# EAGLE design CDTV-SCSI-SD (EAGLE 7.5.0)
REVISION: 0.1
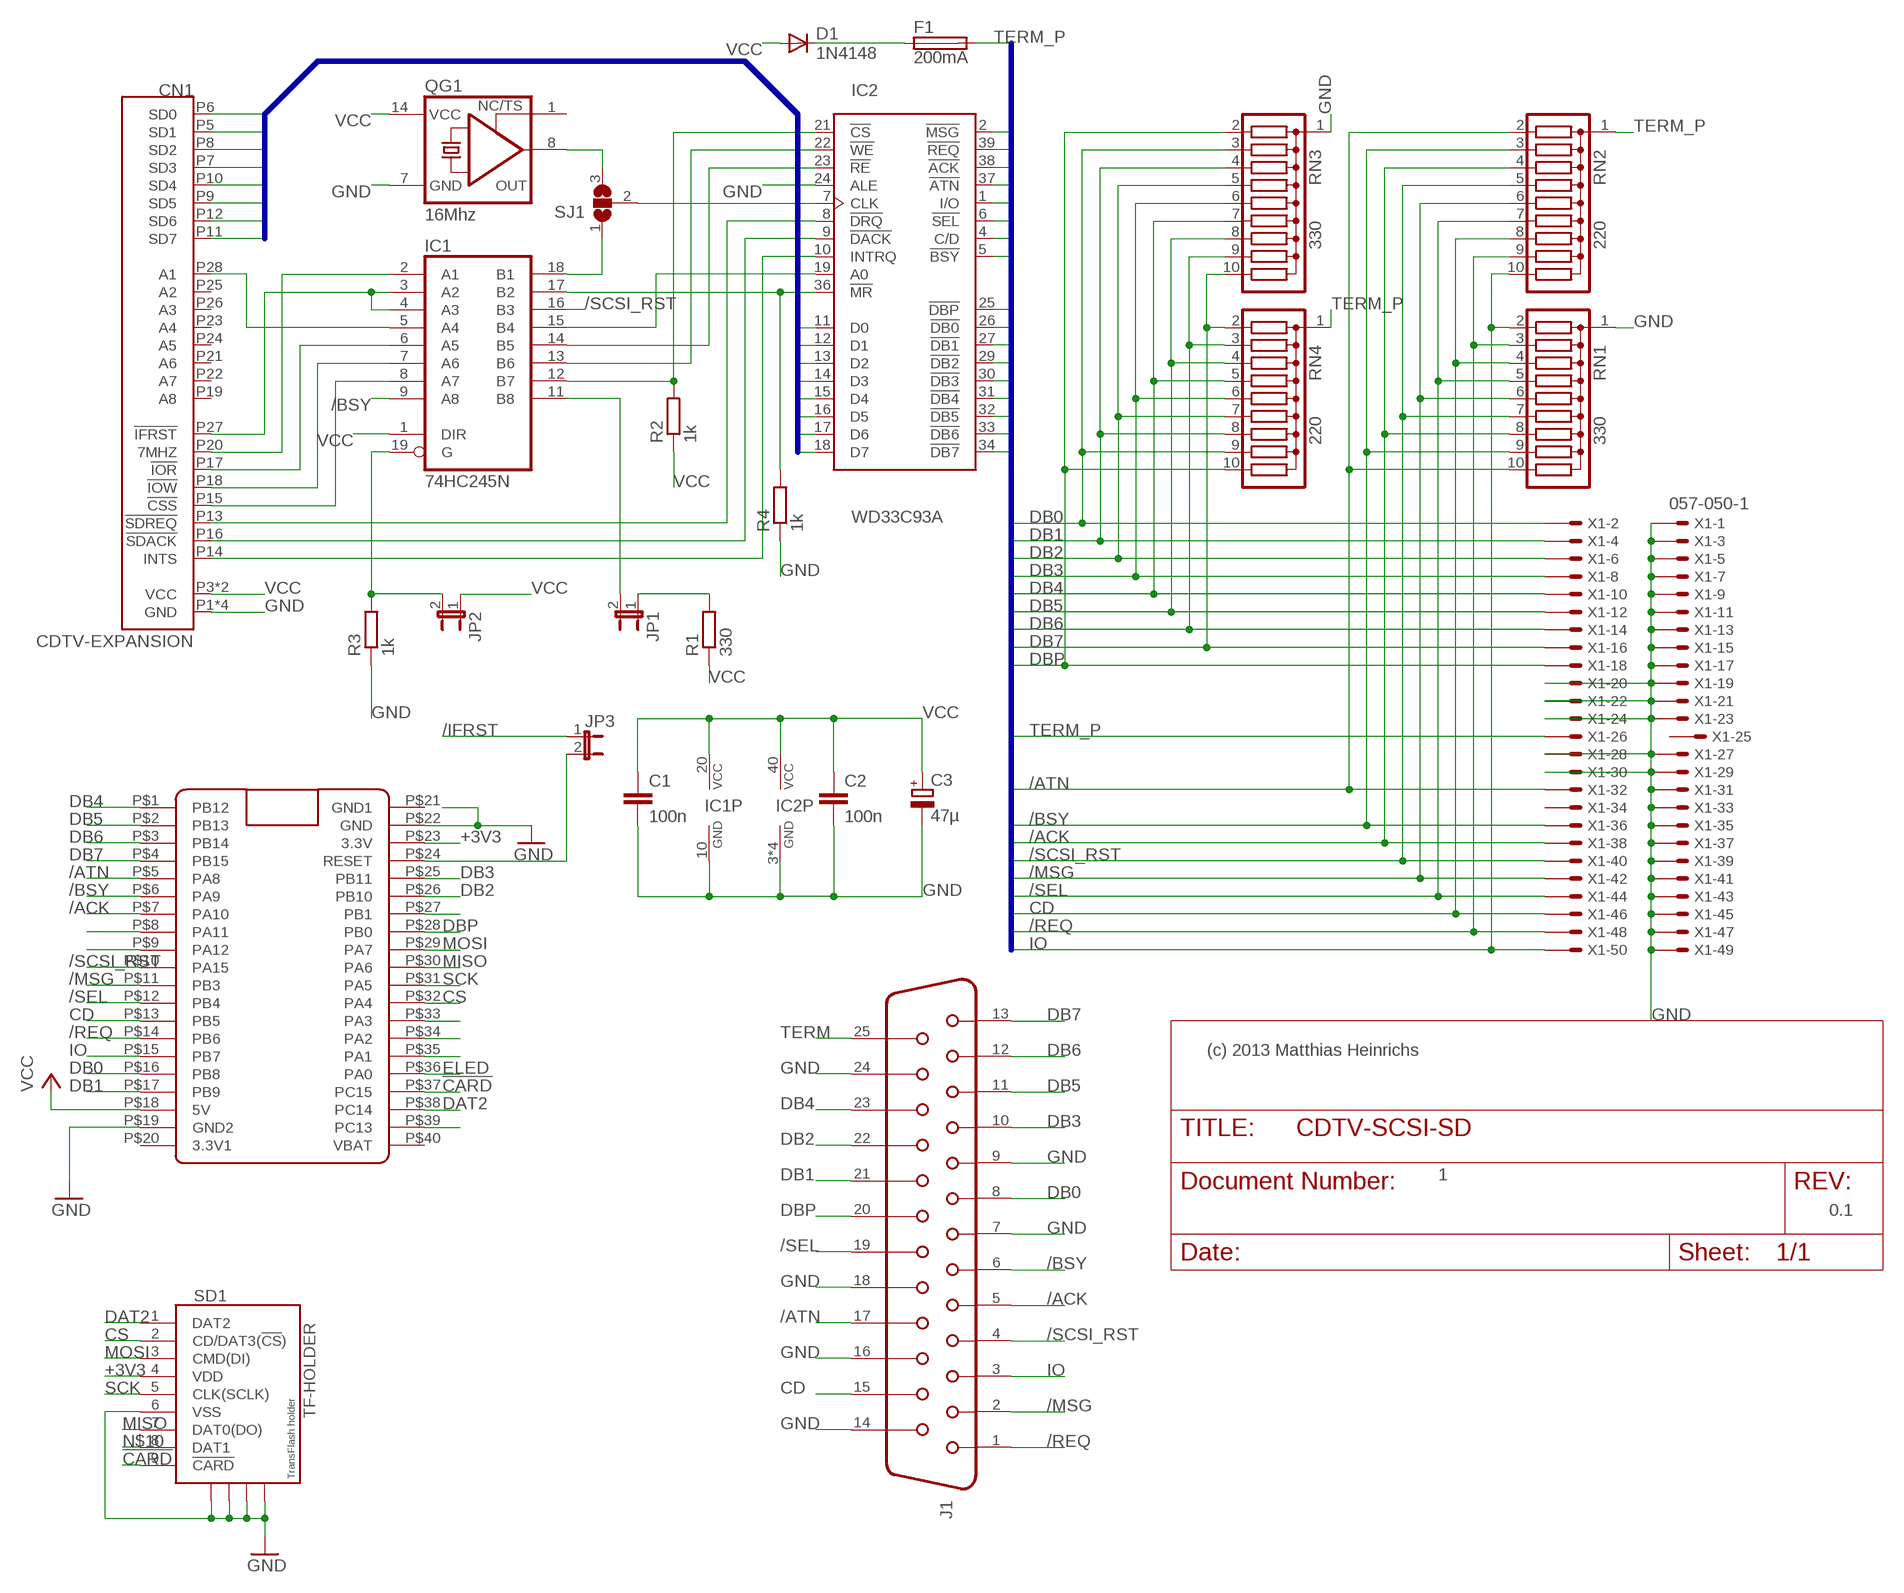
[diagram p0: schematic, sheet 1]

## Parts
C1  100n  C-EU025-024X044  [C025-024X044]
C2  100n  C-EU025-024X044  [C025-024X044]
C3  47µ  CPOL-EUE2,5-6E  [E2,5-6E]
CN1  CDTV-EXPANSION  [CDTV-SLOT]
D1  1N4148  1N4148DO35-7  [DO35-7]
F1  200mA  FUSETE5  [TE5]
IC1  74HC245N  [DIL20]
IC2  WD33C93A  WD33C93  [DIP40-6]
J1  61802529321  [61802529321]
JP1  JP1E  [JP1]
JP2  JP1E  [JP1]
JP3  JP1E  [JP1]
QG1  16Mhz  XO-14  [DIL14S]
R1  330  R-EU_0207/7  [0207/7]
R2  1k  R-EU_0207/7  [0207/7]
R3  1k  R-EU_0207/7  [0207/7]
R4  1k  R-EU_0207/7  [0207/7]
RN1  330  G09R  [SIL10]
RN2  220  G09R  [SIL10]
RN3  330  G09R  [SIL10]
RN4  220  G09R  [SIL10]
SD1  TF-HOLDER  [TF-PULL]
SJ1  SJ2W  [SJ_2]
U$1  BLUE_PILL  [BLUE_PILL]
X1  057-050-1  [057-050-1]

## Nets
7MHZ: CN1.P20(7MHZ) IC1.2(A1)
!CARD: SD1.9(!CARD) U$1.P$37(PC15)
+3V3: SD1.4(VDD) U$1.P$23(3.3V)
/ACK: IC2.38(!ACK) J1.5 RN1.8 RN2.4 U$1.P$7(PA10) X1.38
/ATN: IC2.37(!ATN) J1.17 RN1.10 RN2.2 U$1.P$5(PA8) X1.32
/BSY: IC1.9(A8) IC2.5(!BSY) J1.6 RN1.9 RN2.3 U$1.P$6(PA9) X1.36
/BSY_B: IC1.11(B8) JP1.2
/CS: IC1.12(B7) IC2.21(!CS) R2.2
/CSS: CN1.P15(!CSS) IC1.8(A7)
/ENABLE: IC1.19(G) JP2.2 R3.2
/IFRST: CN1.P27(!IFRST) IC1.3(A2) IC1.4(A3) JP3.1
/INTS: CN1.P14(INTS) IC2.10(INTRQ)
/IOR: CN1.P17(!IOR) IC1.6(A5)
/IOW: CN1.P18(!IOW) IC1.7(A6)
/MR: IC1.17(B2) IC2.36(!MR) R4.2
/MSG: IC2.2(!MSG) J1.2 RN1.6 RN2.6 U$1.P$11(PB3) X1.42
/RE: IC1.14(B5) IC2.23(!RE)
/REQ: IC2.39(!REQ) J1.1 RN1.3 RN2.9 U$1.P$14(PB6) X1.48
/SCSI_RST: IC1.16(B3) J1.4 RN1.7 RN2.5 U$1.P$10(PA15) X1.40
/SDACK: CN1.P16(!SDACK) IC2.9(!DACK)
/SDREQ: CN1.P13(!SDREQ) IC2.8(!DRQ)
/SEL: IC2.6(!SEL) J1.19 RN1.5 RN2.7 U$1.P$12(PB4) X1.44
/WE: IC1.13(B6) IC2.22(!WE)
A1: CN1.P28(A1) IC1.5(A4)
B_A1: IC1.15(B4) IC2.19(A0)
CD: IC2.4(C/D) J1.15 RN1.4 RN2.8 U$1.P$13(PB5) X1.46
CLK: IC2.7(CLK) SJ1.2
CLK_7: IC1.18(B1) SJ1.1
CLK_16M: QG1.8(OUT) SJ1.3
CS: SD1.2(CD/DAT3(!CS!)) U$1.P$32(PA4)
DAT2: SD1.1(DAT2) U$1.P$38(PC14)
DB0: IC2.26(!DB0) J1.8 RN3.3 RN4.9 U$1.P$16(PB8) X1.2
DB1: IC2.27(!DB1) J1.21 RN3.4 RN4.8 U$1.P$17(PB9) X1.4
DB2: IC2.29(!DB2) J1.22 RN3.5 RN4.7 U$1.P$26(PB10) X1.6
DB3: IC2.30(!DB3) J1.10 RN3.6 RN4.6 U$1.P$25(PB11) X1.8
DB4: IC2.31(!DB4) J1.23 RN3.7 RN4.5 U$1.P$1(PB12) X1.10
DB5: IC2.32(!DB5) J1.11 RN3.8 RN4.4 U$1.P$2(PB13) X1.12
DB6: IC2.33(!DB6) J1.12 RN3.9 RN4.3 U$1.P$3(PB14) X1.14
DB7: IC2.34(!DB7) J1.13 RN3.10 RN4.2 U$1.P$4(PB15) X1.16
DBP: IC2.25(!DBP) J1.20 RN3.2 RN4.10 U$1.P$28(PB0) X1.18
ELED: U$1.P$36(PA0)
GND: C1.2 C2.2 C3.- CN1.P1(GND) CN1.P2(GND) CN1.P29(GND) CN1.P30(GND) IC1.10(GND) IC2.3(GND1) IC2.20(GND1) IC2.24(ALE) IC2.28(GND1) IC2.35(GND1) J1.7 J1.9 J1.14 J1.16 J1.18 J1.24 QG1.7(GND) R3.1 R4.1 RN1.1 RN3.1 SD1.6(VSS) SD1.S1 SD1.S2 SD1.S3 SD1.S4 U$1.P$19(GND2) U$1.P$22(GND) X1.1 X1.3 X1.5 X1.7 X1.9 X1.11 X1.13 X1.15 X1.17 X1.19 X1.20 X1.21 X1.22 X1.23 X1.24 X1.27 X1.28 X1.29 X1.30 X1.31 X1.33 X1.35 X1.37 X1.39 X1.41 X1.43 X1.45 X1.47 X1.49
IO: IC2.1(I/O) J1.3 RN1.2 RN2.10 U$1.P$15(PB7) X1.50
LED_POW: JP1.1 R1.2
MISO: SD1.7(DAT0(DO)) U$1.P$30(PA6)
MOSI: SD1.3(CMD(DI)) U$1.P$29(PA7)
N$2: U$1.P$39(PC13)
N$6: U$1.P$35(PA1)
N$7: U$1.P$34(PA2)
N$8: U$1.P$33(PA3)
N$10: SD1.8(DAT1)
N$21: U$1.P$27(PB1)
N$24: JP3.2 U$1.P$24(RESET)
N$34: U$1.P$9(PA12)
N$35: U$1.P$8(PA11)
SCK: SD1.5(CLK(SCLK)) U$1.P$31(PA5)
SD0: CN1.P6(SD0) IC2.11(D0)
SD1: CN1.P5(SD1) IC2.12(D1)
SD2: CN1.P8(SD2) IC2.13(D2)
SD3: CN1.P7(SD3) IC2.14(D3)
SD4: CN1.P10(SD4) IC2.15(D4)
SD5: CN1.P9(SD5) IC2.16(D5)
SD6: CN1.P12(SD6) IC2.17(D6)
SD7: CN1.P11(SD7) IC2.18(D7)
TERM: J1.25
TERM_P: F1.2 RN2.1 RN4.1 X1.26
TP_UNFUSED: D1.C F1.1
VCC: C1.1 C2.1 C3.+ CN1.P3(VCC) CN1.P4(VCC) D1.A IC1.1(DIR) IC1.20(VCC) IC2.40(VCC1) JP2.1 QG1.14(VCC) R1.1 R2.1 U$1.P$18(5V)
Unconnected: CN1.P19(A8) CN1.P21(A6) CN1.P22(A7) CN1.P23(A4) CN1.P24(A5) CN1.P25(A2) CN1.P26(A3) QG1.1(TS) U$1.P$20(3.3V1) U$1.P$40(VBAT) X1.25 X1.34

## Buses
SD[0..7]
DB[0..7],/MSG,/REQ,/ACK,/ATN,IO,/SEL,CD,/BSY,DBP,TERM_P,/SCSI_RST

## Notes on the sheet
- (c) 2013 Matthias Heinrichs
- 1
- 0.1

## Power pins joined to a net without a drawn wire
GND1: U$1.P$21(GND1)

## Library data of the parts
C1 C2 = rcl:C-EU: CAPACITOR, European symbol
C3 = rcl:CPOL-EU: POLARIZED CAPACITOR, European symbol
CN1 = Amiga:CDTV-EXPANSION: Expansion Port for CDTV and A570
D1 = diode:1N4148: DIODE high speed (Philips)
F1 = fuse:FUSE: Fuse; OC_FARNELL: unknown; OC_NEWARK: unknown
IC1 = 74xx-eu:74*245: Octal BUS TRANSCEIVER, 3-state
IC2 = Amiga:WD33C93: WD33C93 -SCSI-Chip WD33C93A AM33C93 P16
J1 = InputOutputIO (rev18a):61802529321: WR-DSUB Female PCB Connector with Hex Screw, 25 Pins=>Code : Con_I-O_DSUB_PCB_Female_w-screw_61802529321 <http://katalog.we-online.de/media/images/eican/Con_I-O_DSUB_PCB_Female_w-screw_6180xx29321_pf2.jpg> Details see: http://katalog.we-online.de/en/em/DSUB_FEMALE_PCB_CONNECTOR_W_HEX_SCREW_6180XX29321 Created 2014-07-10, Karrer Zheng 2014 (C) Würth Elektronik
JP1-JP3 = jumper:JP1E: JUMPER
QG1 = crystal:XO-: CRYSTAL; OC_FARNELL: unknown; OC_NEWARK: unknown
R1-R4 = rcl:R-EU_: RESISTOR, European symbol
RN1-RN4 = resistor-sil:G09R: SIL RESISTOR; OC_FARNELL: unknown; OC_NEWARK: unknown
SD1 = sd-mmc:TF-HOLDER: TF / Micro SD socket is PUSH-PUSH type, the card can be pushed into and auto locked and pushed out by simply press the card. Surface Mounting type.
SJ1 = jumper:SJ2W: SMD solder JUMPER
U$1 = BluePill:BLUE_PILL
X1 = con-panduit:057-050-: CONNECTOR 50-pin series 057 contact pc board low profile headers; OC_FARNELL: unknown; OC_NEWARK: unknown

## Board
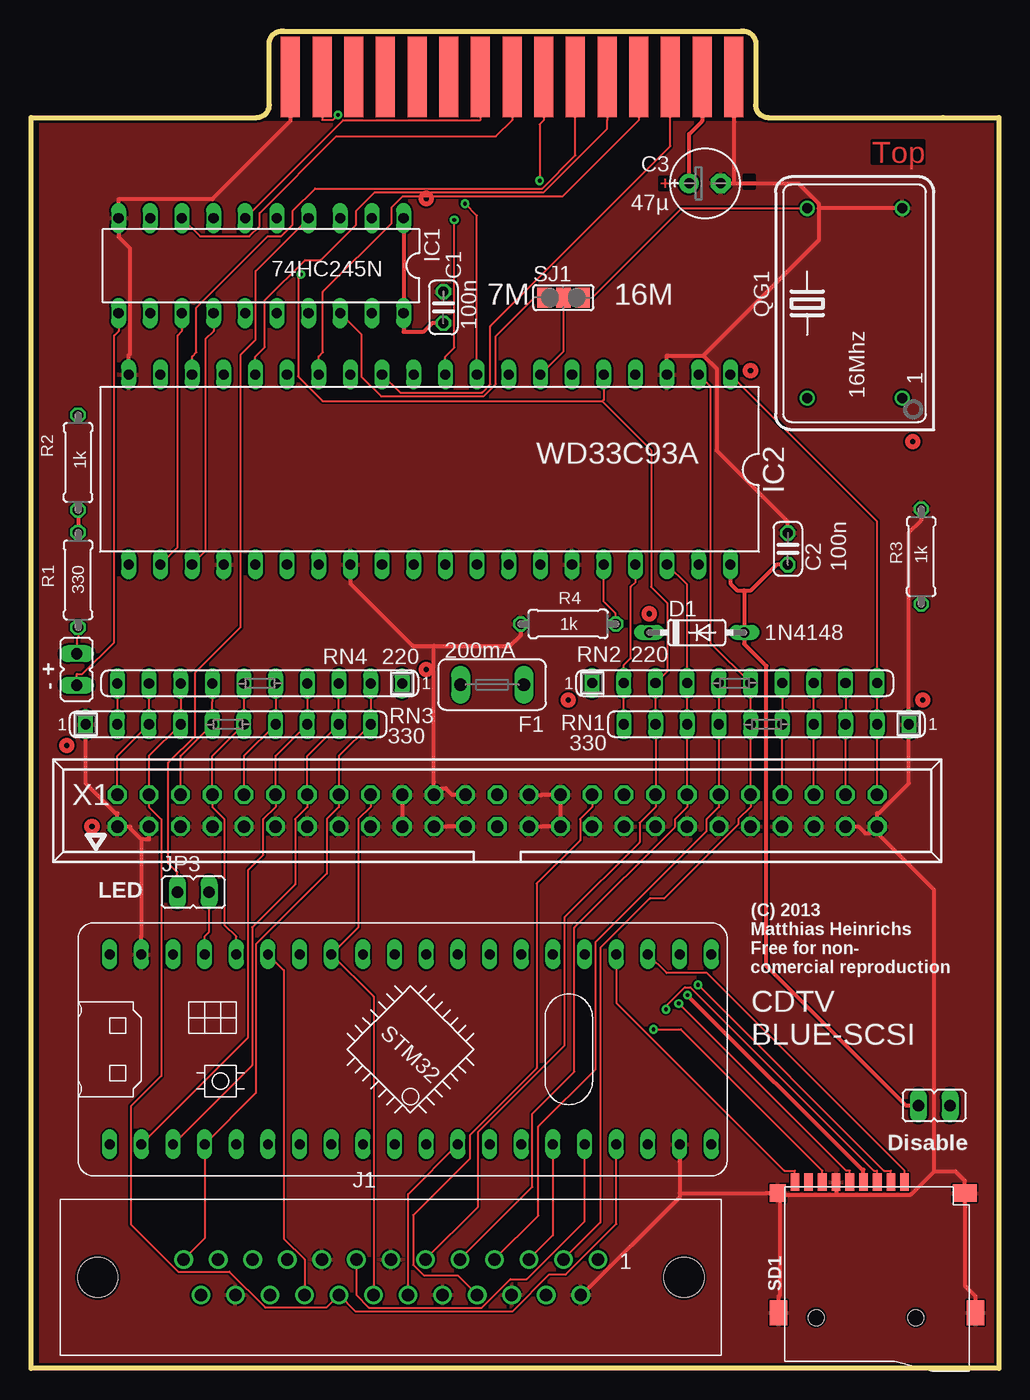
[diagram p1: board, top side]
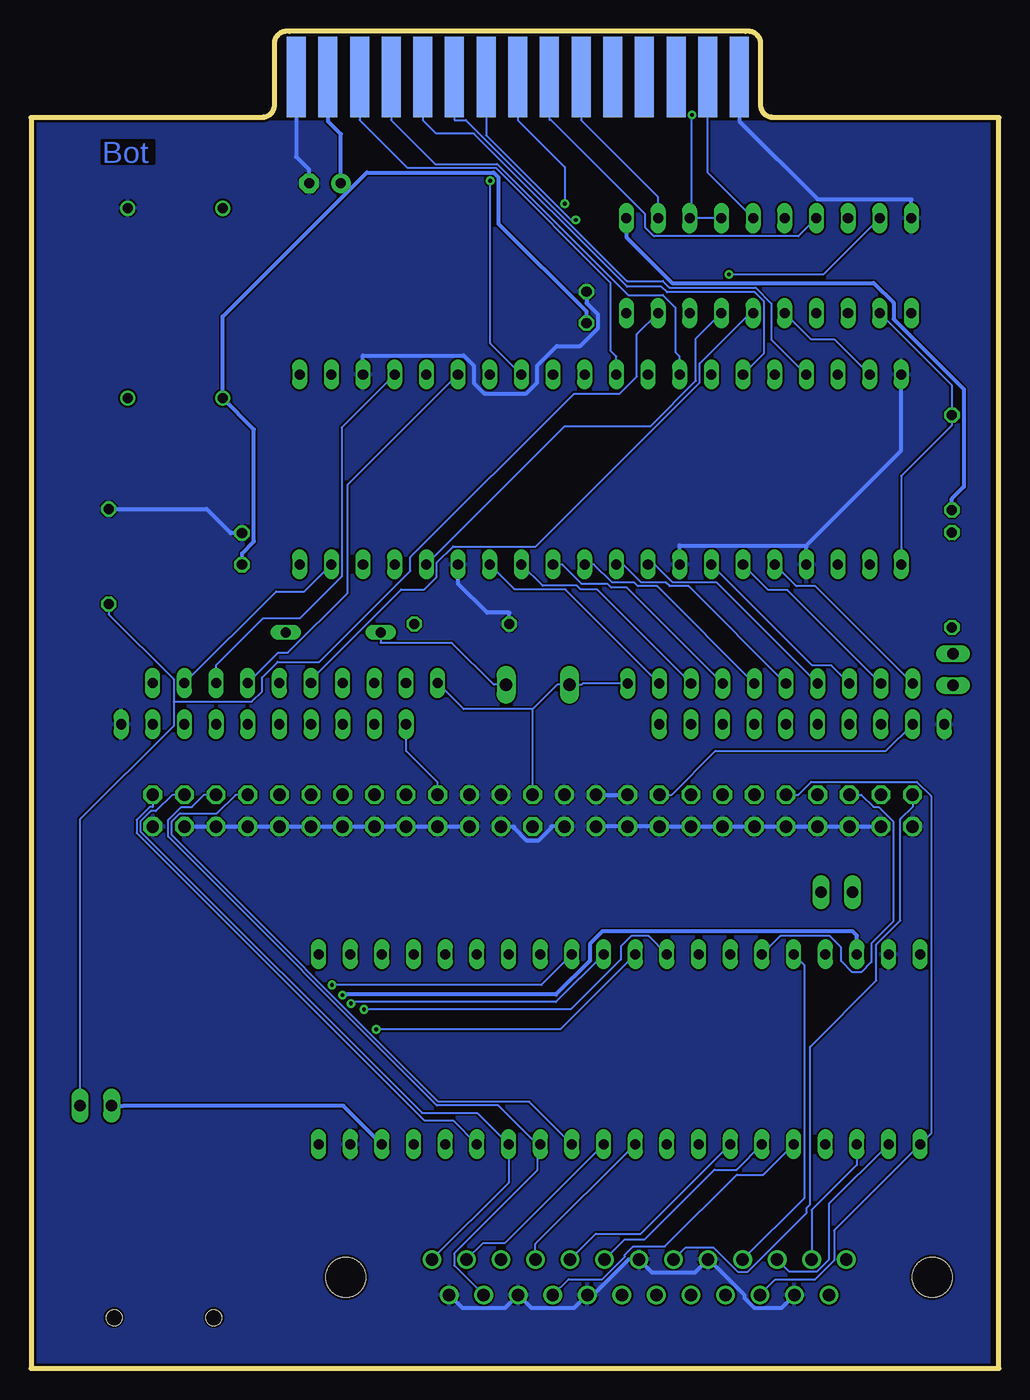
[diagram p2: board, bottom side, seen from below]

Size 77.62 x 107.31 mm. Coordinates in mm from the lower left corner, seen from the top.
Outline: 0,0 0,100.38 18.1,100.38 arc90 19.1,101.38 19.1,106.48 arc-90 20.32,107.29 56.9,107.29 arc-90 58.12,106.48 58.12,101.38 arc90 59.12,100.38 73.15,100.38 77.62,100.38 77.62,0 0,0
Copper layers (1*16): Top 0.035mm / dielectric 1.5mm / Bottom 0.035mm
Design rules "platinensammler_02": minimum track width 0.15mm, minimum drill 0.3mm, track to track 0.15mm, track to pad 0.15mm, pad to pad 0.15mm, via to via 0.15mm, smd to smd 0mil, copper to edge 0.2mm, drill to drill 0.2mm, minimum pad ring 0.2mm, minimum via ring 0.2mm, stop-mask expansion 4mil, vias tented up to drill 0.8mm, thermal gap 0.15mm

### Footprints (pad centres in the part's own frame; a part is rotated, then mirrored left to right if it is on the bottom)
C025-024X044 = drill 0.813 octagon: 1 -1.27,0; 2 1.27,0
E2,5-6E = drill 0.813 pad 1.575: + -1.27,0 | drill 0.813 pad 1.575 octagon: - 1.27,0
CDTV-SLOT = smd 1.524 x 6.477: P1 -17.78,-2.54; P3 -15.24,-2.54; P5 -12.7,-2.54; P7 -10.16,-2.54; P9 -7.62,-2.54; P11 -5.08,-2.54; P13 -2.54,-2.54; P15 0,-2.54; P17 2.54,-2.54; P19 5.08,-2.54; P21 7.62,-2.54; P23 10.16,-2.54; P25 12.7,-2.54; P27 15.24,-2.54; P29 17.78,-2.54 | smd 1.524 x 6.477 bottom: P2 -17.78,-2.54; P4 -15.24,-2.54; P6 -12.7,-2.54; P8 -10.16,-2.54; P10 -7.62,-2.54; P12 -5.08,-2.54; P14 -2.54,-2.54; P16 0,-2.54; P18 2.54,-2.54; P20 5.08,-2.54; P22 7.62,-2.54; P24 10.16,-2.54; P26 12.7,-2.54; P28 15.24,-2.54; P30 17.78,-2.54
DO35-7 = drill 0.813 long: A 3.81,0; C -3.81,0
TE5 = drill 1.016 long: 1 -2.54,0; 2 2.54,0
DIL20 = drill 0.813 long: 1 -11.43,-3.81; 2 -8.89,-3.81; 3 -6.35,-3.81; 4 -3.81,-3.81; 5 -1.27,-3.81; 6 1.27,-3.81; 7 3.81,-3.81; 8 6.35,-3.81; 9 8.89,-3.81; 10 11.43,-3.81; 11 11.43,3.81; 12 8.89,3.81; 13 6.35,3.81; 14 3.81,3.81; 15 1.27,3.81; 16 -1.27,3.81; 17 -3.81,3.81; 18 -6.35,3.81; 19 -8.89,3.81; 20 -11.43,3.81
DIP40-6 = drill 0.813 long: 1 -24.13,-7.62; 2 -21.59,-7.62; 3 -19.05,-7.62; 4 -16.51,-7.62; 5 -13.97,-7.62; 6 -11.43,-7.62; 7 -8.89,-7.62; 8 -6.35,-7.62; 9 -3.81,-7.62; 10 -1.27,-7.62; 11 1.27,-7.62; 12 3.81,-7.62; 13 6.35,-7.62; 14 8.89,-7.62; 15 11.43,-7.62; 16 13.97,-7.62; 17 16.51,-7.62; 18 19.05,-7.62; 19 21.59,-7.62; 20 24.13,-7.62; 21 24.13,7.62; 22 21.59,7.62; 23 19.05,7.62; 24 16.51,7.62; 25 13.97,7.62; 26 11.43,7.62; 27 8.89,7.62; 28 6.35,7.62; 29 3.81,7.62; 30 1.27,7.62; 31 -1.27,7.62; 32 -3.81,7.62; 33 -6.35,7.62; 34 -8.89,7.62; 35 -11.43,7.62; 36 -13.97,7.62; 37 -16.51,7.62; 38 -19.05,7.62; 39 -21.59,7.62; 40 -24.13,7.62
61802529321 = drill 1: 1 16.62,1.42; 2 13.85,1.42; 3 11.08,1.42; 4 8.31,1.42; 5 5.54,1.42; 6 2.77,1.42; 7 0,1.42; 8 -2.77,1.42; 9 -5.54,1.42; 10 -8.31,1.42; 11 -11.08,1.42; 12 -13.85,1.42; 13 -16.62,1.42; 14 15.235,-1.42; 15 12.465,-1.42; 16 9.695,-1.42; 17 6.925,-1.42; 18 4.155,-1.42; 19 1.385,-1.42; 20 -1.385,-1.42; 21 -4.155,-1.42; 22 -6.925,-1.42; 23 -9.695,-1.42; 24 -12.465,-1.42; 25 -15.235,-1.42 | hole 3.2: -23.52,0; 23.52,0
JP1 = drill 0.914 long: 1 0,-1.27; 2 0,1.27
DIL14S = drill 0.813: 1 -7.62,-3.81; 7 7.62,-3.81; 8 7.62,3.81; 14 -7.62,3.81
0207/7 = drill 0.813 octagon: 1 -3.81,0; 2 3.81,0
SIL10 = drill 0.813 long: 1 -11.43,0; 2 -8.89,0; 3 -6.35,0; 4 -3.81,0; 5 -1.27,0; 6 1.27,0; 7 3.81,0; 8 6.35,0; 9 8.89,0; 10 11.43,0
TF-PULL = smd 0.7 x 1.4: 1 -2.2,-7.62; 2 -1.1,-7.62; 3 0,-7.62; 4 1.1,-7.62; 5 2.2,-7.62; 6 3.3,-7.62; 7 4.4,-7.62; 8 5.5,-7.62; 9 6.6,-7.62 | smd 1.4 x 2: S1 -7.9,2.85; S2 7.9,2.85 | smd 1.28 x 1.4: S3 7.96,-6.75 | smd 1.95 x 1.4: S4 -7.025,-6.75 | hole 1.25: -3.1,3.25; 4.9,3.25
SJ_2 = smd 1.168 x 1.6: 1 -1.524,0; 2 0,0; 3 1.524,0
BLUE_PILL = drill 0.8 long: P$1 -7.62,15.24; P$2 -7.62,12.7; P$3 -7.62,10.16; P$4 -7.62,7.62; P$5 -7.62,5.08; P$6 -7.62,2.54; P$7 -7.62,0; P$8 -7.62,-2.54; P$9 -7.62,-5.08; P$10 -7.62,-7.62; P$11 -7.62,-10.16; P$12 -7.62,-12.7; P$13 -7.62,-15.24; P$14 -7.62,-17.78; P$15 -7.62,-20.32; P$16 -7.62,-22.86; P$17 -7.62,-25.4; P$18 -7.62,-27.94; P$19 -7.62,-30.48; P$20 -7.62,-33.02; P$21 7.62,15.24; P$22 7.62,12.7; P$23 7.62,10.16; P$24 7.62,7.62; P$25 7.62,5.08; P$26 7.62,2.54; P$27 7.62,0; P$28 7.62,-2.54; P$29 7.62,-5.08; P$30 7.62,-7.62; P$31 7.62,-10.16; P$32 7.62,-12.7; P$33 7.62,-15.24; P$34 7.62,-17.78; P$35 7.62,-20.32; P$36 7.62,-22.86; P$37 7.62,-25.4; P$38 7.62,-27.94; P$39 7.62,-30.48; P$40 7.62,-33.02
057-050-1 = drill 1 octagon: 1 -30.48,-1.27; 2 -30.48,1.27; 3 -27.94,-1.27; 4 -27.94,1.27; 5 -25.4,-1.27; 6 -25.4,1.27; 7 -22.86,-1.27; 8 -22.86,1.27; 9 -20.32,-1.27; 10 -20.32,1.27; 11 -17.78,-1.27; 12 -17.78,1.27; 13 -15.24,-1.27; 14 -15.24,1.27; 15 -12.7,-1.27; 16 -12.7,1.27; 17 -10.16,-1.27; 18 -10.16,1.27; 19 -7.62,-1.27; 20 -7.62,1.27; 21 -5.08,-1.27; 22 -5.08,1.27; 23 -2.54,-1.27; 24 -2.54,1.27; 25 0,-1.27; 26 0,1.27; 27 2.54,-1.27; 28 2.54,1.27; 29 5.08,-1.27; 30 5.08,1.27; 31 7.62,-1.27; 32 7.62,1.27; 33 10.16,-1.27; 34 10.16,1.27; 35 12.7,-1.27; 36 12.7,1.27; 37 15.24,-1.27; 38 15.24,1.27; 39 17.78,-1.27; 40 17.78,1.27; 41 20.32,-1.27; 42 20.32,1.27; 43 22.86,-1.27; 44 22.86,1.27; 45 25.4,-1.27; 46 25.4,1.27; 47 27.94,-1.27; 48 27.94,1.27; 49 30.48,-1.27; 50 30.48,1.27

### Placement (x,y rotation side)
C1  33.07,85.14 90 top
C2  60.71,65.76 90 top
C3  54.05,95.1 0 top
CN1  38.58,101.09 180 top
D1  53.39,59.05 0 top
F1  36.98,54.86 180 top
IC1  18.44,88.49 180 top
IC2  31.95,72.14 180 top
J1  28.85,7.32 0 top
JP1  3.66,56.08 180 top
JP2  72.44,21.08 270 top
JP3  13,38.2 270 top
QG1  66.07,85.47 90 top
R1  3.76,63.27 270 top
R2  3.76,72.69 90 top
R3  71.4,65.15 270 top
R4  43.08,59.74 0 top
RN1  58.98,51.69 180 top
RN2  56.44,54.99 0 top
RN3  15.8,51.69 0 top
RN4  18.34,54.97 180 top
SD1  67.87,7.32 180 top
SJ1  42.7,85.93 0 top
U$1  21.54,25.6 90 top
X1  37.39,44.75 0 top

### Tracks (layer width: path | path; a pad name or v marks a point on that pad's centre or on a via)
7MHZ
  Bottom 0.15: CN1.P20 33.5,100.17 27.33,94 IC1.2
!CARD
  Top 0.15: U$1.P$37 46.94,31.8 46.94,29.34 60.41,15.86 61.27,15.86 SD1.9
+3V3  (via drill 0.3 pad 0.7)
  Top 0.305: v52.64,29.95 66.65,15.94 66.77,15.94 SD1.4
  Bottom 0.305: 52.59,30 35.52,30 32.81,32.71 32.81,34.05 31.79,35.07 11.72,35.07 11.38,34.73 U$1.P$23 | 52.59,30 | 52.59,30 v52.64,29.95
/ACK
  Top 0.15: IC2.38 52.63,62.89 RN2.4 RN1.8 X1.38 52.63,45.05 51.65,44.07 51.65,43.46 43.57,35.38 43.57,23.8 40.21,20.43 40.21,14.55 J1.5
  Bottom 0.15: J1.5 32.33,10.8 28.72,10.8 U$1.P$7
/ATN
  Top 0.15: IC2.37 48.46,63.07 48.12,62.73 48.12,57 47.55,56.44 RN2.2 RN1.10 | J1.17 34.23,7.45 31.51,7.45 30.65,8.31 30.65,12.29 35.18,16.83 35.18,18.72 40.55,24.09 40.55,38.9 44.03,42.38 44.03,44.07 45.01,45.05 X1.32
  Bottom 0.15: J1.17 34.51,7.16 31.8,7.16 29.99,8.97 29.99,9.11 29.33,9.78 26.78,9.78 21.01,15.54 18.9,15.54 U$1.P$5 | X1.32 45.01,47 47.55,49.54 RN1.10
/BSY  (via drill 0.3 pad 0.7)
  Top 0.15: v21.64,87.78 21.42,87.56 21.42,79.59 23.39,77.61 45.83,77.61 | IC2.5 45.92,77.71 45.83,77.61 | 45.83,77.61 49.73,73.71 49.73,62.71 51.04,61.41 51.04,55.94 RN2.3 RN1.9 X1.36 50.09,45.05 48.81,43.77 48.81,42.2 42.78,36.17 42.78,25.89 35.83,18.93 35.83,12.94 J1.6
  Bottom 0.15: IC1.9 14.07,87.78 v21.64,87.78 | v21.64,87.78 | J1.6 30.01,10.35 28.41,10.35 22.82,15.95 21.03,15.95 U$1.P$6
/BSY_B
  Top 0.15: IC1.11 7.01,83.24 6.65,82.88 6.65,58.26 4.11,55.72 3.66,55.72 JP1.2
/CS
  Bottom 0.15: IC2.21 7.82,71.61 3.76,75.67 R2.2 3.76,78.89 IC1.12
/CSS
  Top 0.15: CN1.P15 38.58,100.17 37.29,98.87 24.49,98.87 18.33,92.72 18.33,91.66 17.51,90.85 13.55,90.85 IC1.8
/ENABLE
  Bottom 0.15: 66.2,53.5 59.92,53.5 59.08,54.34 59.08,55.45 57.85,56.68 54.5,56.68 47.19,63.99 47.19,65.1 34.07,78.22 30.41,78.22 29.04,79.59 29.04,82.98 IC1.19 | 66.2,53.5 66.2,51.54 73.71,44.03 JP2.2 | 66.2,53.5 66.2,55.31 71.4,60.51 R3.2
/IFRST  (via drill 0.3 pad 0.7)
  Top 0.15: JP3.1 11.73,39.8 11.01,40.52 11.01,48.61 13.15,50.75 13.15,55.82 16.81,59.48 16.81,81.34 18.01,82.54 18.01,88.06 IC1.4 | v24.61,100.57 24.21,100.17 23.34,100.17 CN1.P27
  Bottom 0.15: 24.61,92.3 IC1.3 | IC1.4 24.61,92.3 | 24.61,92.3 v24.61,100.57
/INTS  (via drill 0.3 pad 0.7)
  Top 0.15: IC2.10 33.22,81.2 33.94,81.92 v33.94,92.17
  Bottom 0.15: CN1.P14 41.12,98.96 34.33,92.17 v33.94,92.17
/IOR
  Top 0.15: CN1.P17 36.04,100.17 25.04,100.17 IC1.6
/IOW
  Bottom 0.15: CN1.P18 36.04,100.17 35.9,100.17 28.37,92.64 28.37,91.55 27.68,90.86 16.08,90.86 IC1.7
/MR
  Top 0.15: R4.2 46.89,60.58 45.92,61.54 IC2.36
  Bottom 0.15: IC2.36 34.82,75.61 27.93,75.61 24.29,79.25 24.29,82.64 | 24.29,82.64 | 24.29,82.64 IC1.17
/MSG
  Top 0.15: J1.2 45.67,11.7 45.67,33.72 49.64,37.69 50.77,37.69 56.73,43.65 56.73,44.07 57.71,45.05 X1.42 RN1.6 RN2.6 54.51,58.19 54.51,78.79 IC2.2
  Bottom 0.15: U$1.P$11 39.63,10.05 41.39,10.05 J1.2
/RE
  Top 0.15: IC2.23 13.98,65.6 13.98,82.59 14.63,83.24 IC1.14
/REQ
  Top 0.15: X1.48 RN1.3 RN2.9
  Bottom 0.15: 41.82,20.49 46.26,20.49 68.85,43.08 68.85,43.88 68.02,44.71 67.62,44.71 66.3,46.02 X1.48 | 41.82,20.49 | 41.82,20.49 U$1.P$14 39.32,14.89 J1.1 | RN2.9 57.97,62.35 55.71,62.35 IC2.39
/SCSI_RST
  Top 0.15: J1.4 40.68,12.25 40.68,19.41 45.27,24 45.27,34.21 54.19,43.13 54.19,44.07 55.17,45.05 X1.40 RN1.7 RN2.5
  Bottom 0.15: RN2.5 55.17,55.28 47.94,62.51 46.07,62.51 45.09,63.49 45.09,64.65 43.77,65.96 37.14,65.96 23.99,79.11 23.99,80.64 19.95,84.68 IC1.16 | J1.4 37.16,9.98 U$1.P$10
/SDACK  (via drill 0.3 pad 0.7)
  Top 0.15: IC2.9 35.76,92.52 v34.81,93.47
  Bottom 0.15: v34.81,93.47 34.81,96.39 38.58,100.17 CN1.P16
/SDREQ  (via drill 0.3 pad 0.7)
  Top 0.15: v40.79,95.31 40.79,99.84 41.12,100.17 CN1.P13
  Bottom 0.15: IC2.8 40.79,82.24 v40.79,95.31
/SEL
  Top 0.15: J1.19 30.24,13.98 U$1.P$12 | RN2.7 RN1.5 X1.44
  Bottom 0.15: U$1.P$12 37.66,21.4 | 37.66,21.4 | 37.66,21.4 44.95,21.4 66.33,42.79 66.33,43.89 65.68,44.53 62.72,44.53 61.22,46.02 X1.44 | RN2.7 57.81,57.43 57.03,57.43 52.23,62.24 52.23,70.91 IC2.6
/WE
  Top 0.15: IC1.13 12.09,83.24 11.74,82.89 11.74,65.9 IC2.22
A1
  Bottom 0.15: IC1.5 23.34,95.94 CN1.P28
B_A1
  Bottom 0.15: IC2.19 13.17,82.56 15.05,82.56 IC1.15
CD
  Top 0.15: X1.46 RN1.4 RN2.8
  Bottom 0.15: 37.03,17.98 40.15,21.1 | 40.15,21.1 | 40.15,21.1 45.07,21.1 66.64,42.67 66.64,44.01 65.6,45.05 64.74,45.05 63.76,46.02 X1.46 | 37.03,17.98 37.03,15.89 43.69,9.23 43.69,8.26 J1.15 | 37.03,17.98 U$1.P$13 | IC2.4 52.71,75.51 52.71,63.56 56.09,60.18 59.04,60.18 62.79,56.44 RN2.8
CLK
  Top 0.15: SJ1.2 42.7,81.61 IC2.7
CLK_7
  Top 0.15: IC1.18 26.5,82.98 26.5,79.58 28.07,78.01 36.3,78.01 37.28,78.99 37.28,82.85 40.36,85.93 SJ1.1
CLK_16M
  Top 0.15: SJ1.3 45.03,85.93 52.19,93.09 QG1.8
CS  (via drill 0.3 pad 0.7)
  Top 0.15: SD1.2 68.97,15.86 68.41,15.86 v53.5,30.77
  Bottom 0.15: U$1.P$32 36.69,30.77 v53.5,30.77
DAT2
  Top 0.15: U$1.P$38 50.97,31.73 54.2,31.73 70.07,15.86 SD1.1
DB0
  Top 0.15: J1.8 26.08,5.88 27.09,4.88 36.15,4.88 38.44,7.16 39.75,7.16 44.4,11.81 U$1.P$16 | X1.2 6.91,49.15 RN3.3 RN4.9
  Bottom 0.15: J1.8 25.11,9.71 22.9,9.71 20.92,7.73 20.15,7.73 15.41,12.48 15.41,12.88 15.12,13.16 15.12,25.8 9.81,31.12 9.81,34.02 7.88,35.95 7.88,44.07 6.91,45.05 X1.2 | RN4.9 16.96,62.48 18.48,62.48 IC2.26
DB1
  Top 0.15: U$1.P$17 46.94,11.58 42.89,7.53 41.57,7.53 38.62,4.58 26.02,4.58 J1.21 23.7,4.9 18.77,4.9 15.9,7.76 11.8,7.76 8.01,11.55 8.01,21.03 10.44,23.47 10.44,44.06 9.45,45.05 X1.4 9.45,49.15 RN3.4 RN4.8
  Bottom 0.15: RN4.8 13.43,56.41 14.96,56.41 IC2.27
DB2
  Top 0.15: X1.6 11.99,49.15 RN3.5 14.53,53.52 RN4.7 | U$1.P$26 20.27,31.95 20.27,10.4 21.93,8.74 J1.22
  Bottom 0.15: X1.6 11.01,46.02 10.04,45.05 9.63,45.05 8.47,43.89 8.47,35.86 10.23,34.11 10.23,32.6 11.04,31.79 11.74,31.79 12.65,32.7 12.65,33.79 13.55,34.69 17.53,34.69 U$1.P$26 | RN4.7 22.63,63.07 26.14,63.07 27.58,64.52 IC2.29
DB3
  Top 0.15: U$1.P$25 16.46,34.65 15.5,35.6 15.5,44.07 14.53,45.05 X1.8 14.53,49.15 RN3.6 RN4.6
  Bottom 0.15: U$1.P$25 15.62,32.39 15.62,13.66 J1.10 | RN4.6 24.87,62.77 26.41,62.77 26.71,63.07 28.69,63.07 30.13,64.52 IC2.30
DB4
  Top 0.15: X1.10 17.07,49.15 RN3.7 RN4.5
  Bottom 0.15: X1.10 16.09,46.02 15.06,47.06 6.56,47.06 5.43,45.93 5.43,18.85 U$1.P$1 13.21,11.07 13.21,8.67 14.78,7.1 17.95,7.1 J1.23 | RN4.5 27.41,62.76 28.95,62.76 29.25,63.06 31.02,63.06 32.47,64.52 IC2.31
DB5
  Top 0.15: U$1.P$2 17.41,26.55 17.41,39.98 18.63,41.21 18.63,44.07 19.61,45.05 X1.12 19.61,49.15 RN3.8 RN4.4
  Bottom 0.15: RN4.4 29.84,62.66 31.08,62.66 31.38,62.96 33.45,62.96 35.01,64.52 IC2.32 | U$1.P$2 13.62,13.2 13.62,8.72 14.59,7.75 16.79,7.75 J1.11
DB6
  Top 0.15: U$1.P$3 17.72,24.33 17.72,35.4 21.17,38.85 21.17,44.07 22.15,45.05 X1.14 22.15,49.15 RN3.9 RN4.3
  Bottom 0.15: U$1.P$3 11.38,16.33 15,12.71 J1.12 | RN4.3 32.23,62.51 33.55,62.51 33.85,62.81 36.59,62.81 IC2.33
DB7
  Top 0.15: J1.13 13.92,10.42 U$1.P$4 18.02,22.09 18.02,34.01 23.71,39.7 23.71,44.07 24.69,45.05 X1.16 24.69,49.15 RN3.10 RN4.2
  Bottom 0.15: RN4.2 34.77,62.51 38.83,62.51 IC2.34
DBP
  Top 0.15: J1.20 27.47,29.83 U$1.P$28 26.25,35.4 26.25,44.07 27.23,45.05 X1.18 | RN4.10 RN3.2
  Bottom 0.15: X1.18 26.25,46.02 22.73,49.55 9.05,49.55 RN3.2 | RN4.10 14.72,62.78 16.24,62.78 IC2.25
GND
  Top 0.305: IC2.20 7.82,81.28 7.94,81.39 7.94,89.85 7.01,90.78 IC1.10 7.01,93.83 14.54,93.83 20.8,100.09 CN1.P30 | X1.24 33.8,46.02 33.27,46.55 32.31,46.55 | 32.31,46.55 32.31,47.08 32.31,57.97 | X1.22 32.31,46.55 | 32.31,57.97 38.41,57.97 39.27,58.83 R4.1 | 32.31,57.97 30.63,57.97 25.6,62.99 IC2.28 | X1.28 40.98,46.02 X1.30 X1.29 40.98,43.48 X1.27 | 63.18,93.09 63.18,90.53 53.93,81.28 | 56.41,95.1 61.55,95.1 63.18,93.47 63.18,93.09 | QG1.7 63.18,93.09 | 53.93,81.28 54.98,80.23 54.98,73.67 60.71,67.94 C2.2 | 53.93,81.28 51,81.28 IC2.3 | 56.41,95.1 56.41,100.04 56.36,100.09 CN1.P2 | C3.- 56.41,95.1 | 72.44,15.82 72.44,38.39 67.87,42.96 | 64.57,13.93 70.56,13.93 72.44,15.82 | 72.44,15.82 74.15,15.82 74.89,15.07 SD1.S4 74.89,13.56 74.89,6.64 75.77,5.77 SD1.S1 | 60.04,13.93 64.57,13.93 | 67.87,42.96 66.91,42.96 66.38,43.48 X1.47 | 67.87,42.96 X1.49 67.87,44.54 68,44.54 70.41,46.95 RN1.1 70.41,67.06 71.4,68.05 R3.1 | 8.84,42.43 8.84,34.73 U$1.P$22 | 8.84,42.43 9.45,42.43 X1.3 | 8.84,42.43 7.96,43.31 7.96,43.48 X1.1 6.91,44.54 6.78,44.54 4.37,46.95 RN3.1 | X1.23 33.36,43.48 X1.21 | 52.02,14.07 52.02,13.73 44.19,5.9 J1.14 | 52.02,14.07 52.02,16.59 U$1.P$19 | 52.02,14.07 58.97,14.07 SD1.S3 60.04,13.93 | 60.04,13.93 60.04,5.84 59.97,5.77 SD1.S2 | SD1.6 64.57,13.93 | X1.20 X1.19
  Bottom 0.305: C2.2 61.62,67.03 63.55,68.96 R3.1 | 15.44,66.04 7.82,73.66 IC2.20 | 15.44,66.04 15.44,65.92 IC2.24 | IC2.28 25.6,66.04 15.44,66.04 | X1.47 X1.45 X1.43 X1.41 X1.39 X1.37 X1.35 48.6,43.48 X1.33 X1.31 X1.29 | C3.- 55.32,96.19 56.36,97.23 CN1.P2 | X1.21 X1.19 X1.17 X1.15 X1.13 X1.11 X1.9 X1.7 X1.5 X1.3 | X1.23 35.9,43.48 35.9,43.38 36.9,42.38 37.9,42.38 38.88,43.35 38.88,43.48 X1.27 | J1.14 43.04,4.84 39.6,4.84 J1.16 37.5,4.84 34.06,4.84 J1.18 32.53,5.9 29.69,8.74 J1.7 27.8,7.68 24.37,7.68 J1.9 23.26,8.74 20.38,5.86 20.38,5.63 19.58,4.82 17.46,4.82 J1.24 | C1.2 33.07,85.5 32.14,84.57 32.14,83.49 33.59,82.04 35.45,82.04 37.03,80.46 37.03,79.09 37.89,78.23 41.27,78.23 42.11,79.07 42.11,80.46 42.93,81.28 51,81.28 IC2.3 | IC2.35 43.38,62.99 41.04,60.65 39.27,60.65 R4.1 | IC1.10 7.01,93.83 14.54,93.83 20.8,100.09 CN1.P30 | X1.22 X1.20
  pour Bottom: 0.81,99.97 77.62,99.97 77.62,0 0.81,0
  pour Top: 0.81,99.97 77.22,99.97 77.22,0 0.81,0
IO
  Top 0.15: IC2.1 67.87,67.97 RN2.10 RN1.2 X1.50 | U$1.P$15 41.86,10.66 J1.3
  Bottom 0.15: X1.50 67.87,45.05 68.11,45.05 69.15,44.01 69.15,42.96 46.08,19.89 43.76,19.89 U$1.P$15
LED_POW
  Top 0.15: R1.2 3.76,58.63 3.66,58.53 JP1.1
MISO  (via drill 0.3 pad 0.7)
  Top 0.15: v49.93,27.21 52.12,27.21 63.47,15.86 SD1.7
  Bottom 0.15: U$1.P$30 35.17,27.21 v49.93,27.21
MOSI  (via drill 0.3 pad 0.7)
  Top 0.15: v50.92,28.82 50.92,29.06 52.44,30.58 52.88,30.58 67.59,15.86 67.87,15.86 SD1.3
  Bottom 0.15: U$1.P$29 28.09,34.69 29.49,34.69 30.32,33.86 30.32,32.82 34.32,28.82 v50.92,28.82
N$24
  Top 0.15: U$1.P$24 13.92,34.65 14.27,35 JP3.2
SCK  (via drill 0.3 pad 0.7)
  Top 0.15: v51.96,29.28 65.38,15.86 65.67,15.86 SD1.5
  Bottom 0.15: U$1.P$31 35.53,29.39 51.85,29.39 v51.96,29.28
SD0
  Bottom 0.15: CN1.P6 51.28,100.17 47.45,96.34 40.36,96.34 31.15,87.13 31.15,81.67 30.68,81.2 IC2.11
SD1
  Top 0.15: IC2.12 29.59,78.31 36.18,78.31 36.83,78.97 36.83,83.64 51.28,98.09 CN1.P5
SD2
  Bottom 0.15: CN1.P8 48.74,100.17 45.21,96.64 40.24,96.64 29.73,86.13 26.95,86.13 25.95,85.13 25.95,81.55 25.6,81.2 IC2.13
SD3
  Top 0.15: CN1.P7 48.74,100.17 42.65,94.08 29.83,94.08 28.92,93.17 28.92,91.92 23.41,86.4 23.41,81.55 23.06,81.2 IC2.14
SD4
  Bottom 0.15: CN1.P10 46.2,100.17 45.12,99.09 42.11,99.09 29.82,86.8 27.06,86.8 26.61,86.35 19.56,86.35 18.83,85.62 18.83,81.45 IC2.15
SD5
  Top 0.15: CN1.P9 46.2,100.17 46.2,99.47 41.11,94.38 27.55,94.38 26.06,92.89 26.06,91.78 23.22,88.94 21.99,88.94 18.75,85.71 18.75,81.97 17.98,81.2 IC2.16
SD6
  Bottom 0.15: IC2.17 18.24,82.55 18.24,85.45 19.52,86.73 26.41,86.73 26.94,87.25 29.84,87.25 42.76,100.17 43.66,100.17 CN1.P12
SD7
  Top 0.15: IC2.18 12.9,81.2 13.25,81.55 13.25,85.14 18.96,90.85 20.06,90.85 20.98,91.77 20.98,92.88 22.78,94.68 40.99,94.68 43.66,97.35 CN1.P11
TERM_P
  Bottom 0.15: 37.39,52.9 35.43,54.86 F1.2 33.95,54.86 33.46,54.86 33.35,54.97 RN4.1 | X1.26 37.39,52.9 | 37.39,52.9 42.92,52.9 RN2.1
TP_UNFUSED
  Bottom 0.15: D1.C 49.58,58.22 43.87,58.22 40.51,54.86 F1.1
VCC
  Top 0.305: CN1.P4 53.82,100.09 52.78,99.05 C3.+ | IC1.1 IC1.20 29.87,83.16 31.45,83.16 32.16,83.87 C1.1 | 57.2,62.44 57.74,62.44 59.79,64.49 C2.1 | 57.2,62.44 56.64,62.44 56.08,62.99 IC2.40 | 57.2,62.44 D1.A 57.2,58.14 58.98,56.37 58.98,32.29 70.18,21.08 JP2.1 | R2.1 R1.1
  Bottom 0.305: JP2.1 70.18,21.08 52.58,21.08 U$1.P$18 | 52.17,94.49 50.7,95.96 40.52,95.96 40.14,95.58 40.14,91.85 33.07,84.78 C1.1 | 52.17,94.49 62.26,84.4 QG1.14 59.76,75.35 59.76,66.35 60.71,65.4 C2.1 | 52.17,94.49 C3.+ 52.78,99.05 53.82,100.09 CN1.P4 | R2.1 3.76,69.8 2.81,70.75 2.81,78.58 8.44,84.22 8.44,85.51 10.04,87.11 26.19,87.11 29.87,90.78 IC1.1
(copper drawn outside any net)
  shapes: Top circle x9

### Text on the board
Top: Top | + | -
Bottom: Bot
tNames: 7M | 16M | - + | LED | (C) 2013 / Matthias Heinrichs / Free for non- / comercial reproduction | CDTV / BLUE-SCSI | Disable